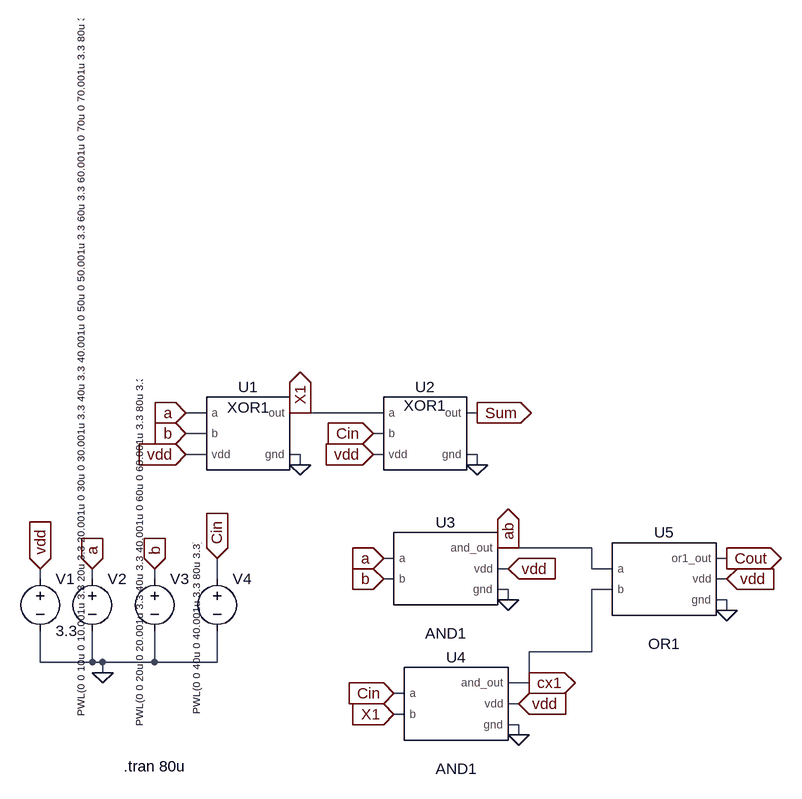
[diagram p0: schematic 1-bit-full-adder.asc]
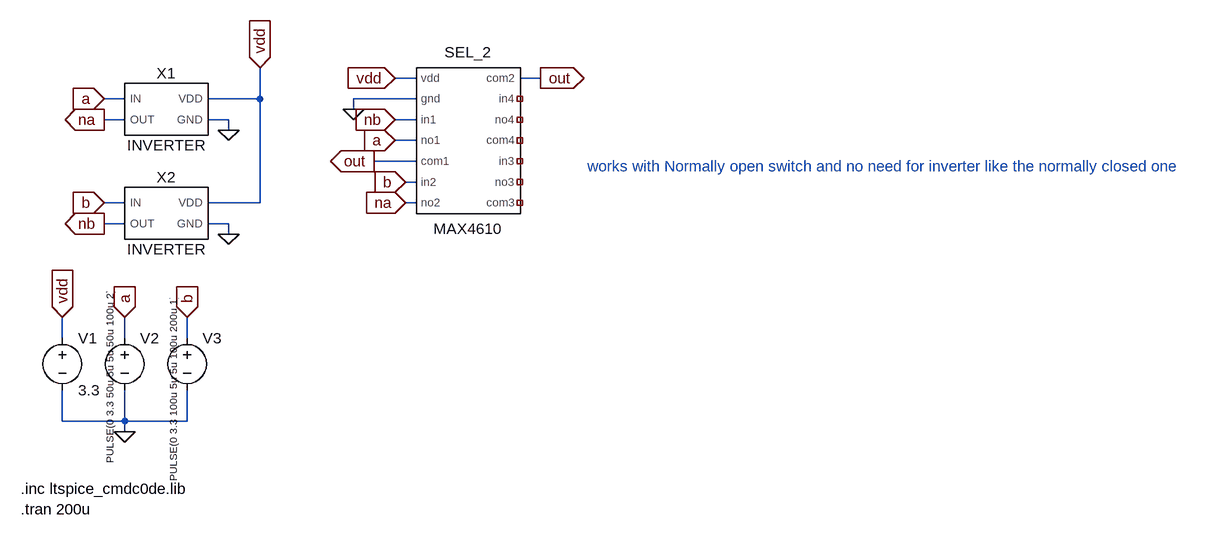
[diagram p1: sub-circuit xor_max4610.asc]
1-bit-full-adder.asc, the LTspice schematic file:
Version 4.1
SHEET 1 904 680
WIRE -80 80 -112 80
WIRE 64 80 48 80
WIRE 192 80 64 80
WIRE 336 80 320 80
WIRE -80 112 -112 112
WIRE 192 112 176 112
WIRE -80 144 -112 144
WIRE 64 144 48 144
WIRE 192 144 176 144
WIRE 336 144 320 144
WIRE 64 160 64 144
WIRE 336 160 336 144
WIRE 384 288 368 288
WIRE 512 288 384 288
WIRE 208 304 192 304
WIRE 720 304 704 304
WIRE 384 320 368 320
WIRE 512 320 512 288
WIRE 544 320 512 320
WIRE -336 336 -336 320
WIRE -256 336 -256 320
WIRE -160 336 -160 320
WIRE -64 336 -64 304
WIRE 208 336 192 336
WIRE 720 336 704 336
WIRE 384 352 368 352
WIRE 544 352 512 352
WIRE 384 368 384 352
WIRE 720 368 704 368
WIRE 720 384 720 368
WIRE 512 448 512 352
WIRE 512 448 416 448
WIRE -336 464 -336 416
WIRE -256 464 -256 416
WIRE -256 464 -336 464
WIRE -240 464 -256 464
WIRE -160 464 -160 416
WIRE -160 464 -240 464
WIRE -64 464 -64 416
WIRE -64 464 -160 464
WIRE -240 480 -240 464
WIRE 416 496 416 448
WIRE 416 496 384 496
WIRE 224 512 208 512
WIRE 400 528 384 528
WIRE 224 544 208 544
WIRE 400 560 384 560
WIRE 400 576 400 560
FLAG 64 80 X1
IOPIN 64 80 Out
FLAG -112 80 a
IOPIN -112 80 In
FLAG -112 112 b
IOPIN -112 112 In
FLAG -112 144 vdd
IOPIN -112 144 In
FLAG 64 160 0
FLAG 176 112 Cin
IOPIN 176 112 In
FLAG 176 144 vdd
IOPIN 176 144 In
FLAG 336 80 Sum
IOPIN 336 80 Out
FLAG 336 160 0
FLAG 384 368 0
FLAG 384 320 vdd
IOPIN 384 320 In
FLAG 192 304 a
IOPIN 192 304 In
FLAG 192 336 b
IOPIN 192 336 In
FLAG 384 288 ab
IOPIN 384 288 Out
FLAG 400 576 0
FLAG 400 528 vdd
IOPIN 400 528 In
FLAG 208 512 Cin
IOPIN 208 512 In
FLAG 208 544 X1
IOPIN 208 544 In
FLAG 416 496 cx1
IOPIN 416 496 Out
FLAG 720 384 0
FLAG 720 336 vdd
IOPIN 720 336 In
FLAG 720 304 Cout
IOPIN 720 304 Out
FLAG -240 480 0
FLAG -336 320 vdd
IOPIN -336 320 In
FLAG -256 320 a
IOPIN -256 320 In
FLAG -160 320 b
IOPIN -160 320 In
FLAG -64 304 Cin
IOPIN -64 304 In
SYMBOL xor_max4610 -16 112 R0
WINDOW 38 0 -56 Top 2
SYMATTR InstName U1
SYMBOL xor_max4610 256 112 R0
WINDOW 38 0 -28 Bottom 2
SYMATTR InstName U2
SYMBOL and1 288 320 R0
WINDOW 3 0 56 Invisible 2
WINDOW 38 0 84 Top 2
SYMATTR InstName U3
SYMATTR Value ""
SYMBOL and1 304 528 R0
WINDOW 3 0 56 Invisible 2
WINDOW 38 0 84 Top 2
SYMATTR InstName U4
SYMATTR Value ""
SYMBOL or1 624 336 R0
WINDOW 3 0 56 Invisible 2
WINDOW 38 0 84 Top 2
SYMATTR InstName U5
SYMATTR Value ""
SYMBOL voltage -336 320 R0
WINDOW 123 0 0 Left 0
WINDOW 39 0 0 Left 0
SYMATTR InstName V1
SYMATTR Value 3.3
SYMBOL voltage -256 320 R0
WINDOW 3 -17 228 VLeft 1
WINDOW 123 0 0 Left 0
WINDOW 39 0 0 Left 0
SYMATTR Value PWL(0 0 10u 0 10.001u 3.3 20u 3.3 20.001u 0 30u 0 30.001u 3.3 40u 3.3 40.001u 0 50u 0 50.001u 3.3 60u 3.3 60.001u 0 70u 0 70.001u 3.3 80u 3.3)
SYMATTR InstName V2
SYMBOL voltage -160 320 R0
WINDOW 3 -23 243 VLeft 1
WINDOW 123 0 0 Left 0
WINDOW 39 0 0 Left 0
SYMATTR Value PWL(0 0 20u 0 20.001u 3.3 40u 3.3 40.001u 0 60u 0 60.001u 3.3 80u 3.3)
SYMATTR InstName V3
SYMBOL voltage -64 320 R0
WINDOW 3 -32 225 VLeft 1
WINDOW 123 0 0 Left 0
WINDOW 39 0 0 Left 0
SYMATTR InstName V4
SYMATTR Value PWL(0 0 40u 0 40.001u 3.3 80u 3.3)
TEXT -208 624 Left 2 !.tran 80u

xor_max4610.asc, the sub-circuit schematic file:
Version 4.1
SHEET 1 1704 1020
WIRE 432 48 400 48
WIRE 624 48 592 48
WIRE -16 80 -48 80
WIRE 192 80 192 32
WIRE 192 80 112 80
WIRE 432 80 336 80
WIRE 336 96 336 80
WIRE -16 112 -48 112
WIRE 144 112 112 112
WIRE 432 112 400 112
WIRE 144 128 144 112
WIRE 432 144 400 144
WIRE 432 176 368 176
WIRE 432 208 416 208
WIRE -16 240 -48 240
WIRE 192 240 192 80
WIRE 192 240 112 240
WIRE 432 240 416 240
WIRE -16 272 -48 272
WIRE 144 272 112 272
WIRE 144 288 144 272
WIRE -112 448 -112 416
WIRE -16 448 -16 416
WIRE 80 448 80 416
WIRE -112 576 -112 528
WIRE -16 576 -16 528
WIRE -16 576 -112 576
WIRE 80 576 80 528
WIRE 80 576 -16 576
WIRE -16 592 -16 576
FLAG -48 80 a
IOPIN -48 80 In
FLAG -48 112 na
IOPIN -48 112 Out
FLAG 144 128 0
FLAG 144 288 0
FLAG -48 240 b
IOPIN -48 240 In
FLAG -48 272 nb
IOPIN -48 272 Out
FLAG -16 592 0
FLAG -112 416 vdd
IOPIN -112 416 In
FLAG -16 416 a
IOPIN -16 416 In
FLAG 80 416 b
IOPIN 80 416 In
FLAG 192 32 vdd
IOPIN 192 32 In
FLAG 336 96 0
FLAG 400 48 vdd
IOPIN 400 48 In
FLAG 400 112 nb
IOPIN 400 112 In
FLAG 400 144 a
IOPIN 400 144 In
FLAG 368 176 out
IOPIN 368 176 Out
FLAG 416 208 b
IOPIN 416 208 In
FLAG 416 240 na
IOPIN 416 240 In
FLAG 624 48 out
IOPIN 624 48 Out
SYMBOL inverter 48 96 R0
SYMATTR InstName X1
SYMATTR SpiceModel ""
SYMBOL inverter 48 256 R0
SYMATTR InstName X2
SYMATTR SpiceModel ""
SYMBOL voltage -112 432 R0
WINDOW 123 0 0 Left 0
WINDOW 39 0 0 Left 0
SYMATTR InstName V1
SYMATTR Value 3.3
SYMBOL voltage -16 432 R0
WINDOW 3 -23 209 VLeft 1
WINDOW 123 0 0 Left 0
WINDOW 39 0 0 Left 0
SYMATTR Value PULSE(0 3.3 50u 5u 5u 50u 100u 2)
SYMATTR InstName V2
SYMBOL voltage 80 432 R0
WINDOW 3 -21 237 VLeft 1
WINDOW 123 0 0 Left 0
WINDOW 39 0 0 Left 0
SYMATTR Value PULSE(0 3.3 100u 5u 5u 100u 200u 1)
SYMATTR InstName V3
SYMBOL MAX4610 512 144 R0
SYMATTR InstName SEL_2
TEXT -176 680 Left 2 !.inc ltspice_cmdc0de.lib\n.tran 200u
TEXT 696 184 Left 2 ;works with Normally open switch and no need for inverter like the normally closed one

The netlist it stands for:
* 1-bit-full-adder.asc
X§U1 a b X1 vdd 0 xor_max4610
X§U2 X1 Cin Sum vdd 0 xor_max4610
X§U3 a b ab vdd 0 AND1  ; pins a b and_out vdd gnd
X§U4 Cin X1 cx1 vdd 0 AND1  ; pins a b and_out vdd gnd
X§U5 ab cx1 Cout vdd 0 OR1  ; pins a b or1_out vdd gnd
V1 vdd 0 3.3
V2 a 0 PWL(0 0 10u 0 10.001u 3.3 20u 3.3 20.001u 0 30u 0 30.001u 3.3 40u 3.3 40.001u 0 50u 0 50.001u 3.3 60u 3.3 60.001u 0 70u 0 70.001u 3.3 80u 3.3)
V3 b 0 PWL(0 0 20u 0 20.001u 3.3 40u 3.3 40.001u 0 60u 0 60.001u 3.3 80u 3.3)
V4 Cin 0 PWL(0 0 40u 0 40.001u 3.3 80u 3.3)

* block symbol definitions
.subckt xor_max4610 a b out vdd gnd
X§X1 a na vdd 0 INVERTER  ; pins IN OUT VDD GND
X§X2 b nb vdd 0 INVERTER  ; pins IN OUT VDD GND
V1 vdd 0 3.3
V2 a 0 PULSE(0 3.3 50u 5u 5u 50u 100u 2)
V3 b 0 PULSE(0 3.3 100u 5u 5u 100u 200u 1)
X§SEL_2 vdd 0 nb a out b na out NC_01 NC_02 NC_03 NC_04 NC_05 NC_06 MAX4610  ; pins vdd gnd in1 no1 com1 in2 no2 com2 in4 no4 com4 in3 no3 com3
.inc ltspice_cmdc0de.lib
.tran 200u
* works with Normally open switch and no need for inverter like the normally closed one
.ends xor_max4610

.tran 80u
.lib ltspice_cmdc0de.lib
.lib yap_cells.lib
.backanno
.end